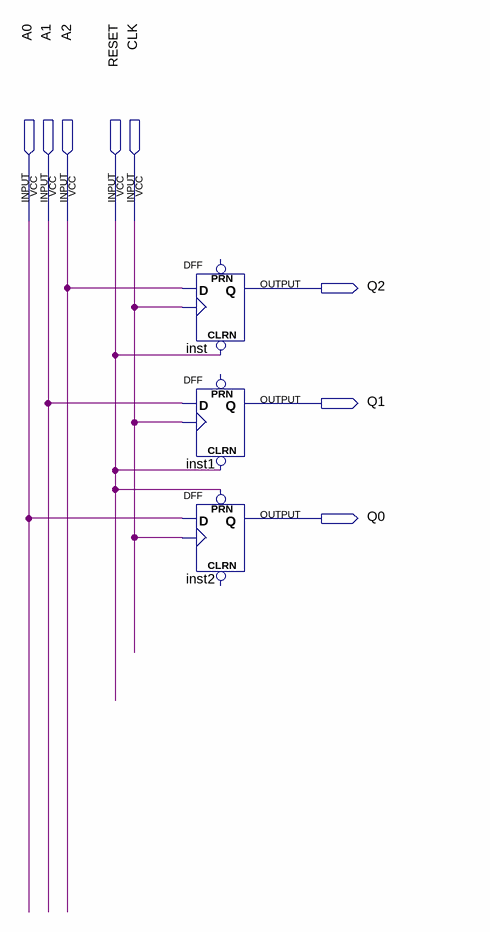
[diagram p0: schematic sheet]
// Quartus schematic pipo3reset1.bdf as structural Verilog: 3 symbols, 8 pins
module pipo3reset1 (
  input  A0,
  input  A1,
  input  A2,
  input  RESET,
  input  CLK,
  output Q2,
  output Q1,
  output Q0
);

  DFF inst (.CLRN(RESET), .CLK(CLK), .D(A2), .Q(Q2));  // open: PRN
  DFF inst1 (.CLRN(RESET), .CLK(CLK), .D(A1), .Q(Q1));  // open: PRN
  DFF inst2 (.CLK(CLK), .D(A0), .PRN(RESET), .Q(Q0));  // open: CLRN
endmodule
